# Altium schematic sheet NeoPixel.SchDoc
size A4; SheetNumber: 2; SheetTotal: 6
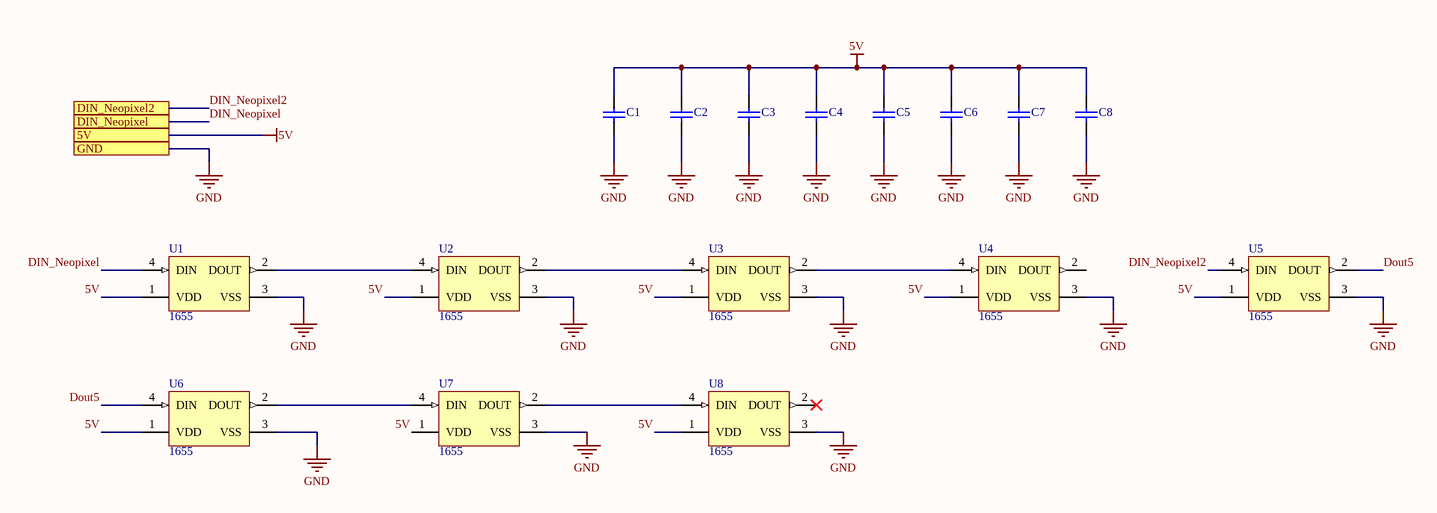
[diagram p0: NeoPixel.SchDoc]

## Parts
C1  C0805C105Z4VACTU  [CAPC2013X140X50ML20T25]  (value not drawn)
C2  C0805C105Z4VACTU  [CAPC2013X140X50ML20T25]  (value not drawn)
C3  C0805C105Z4VACTU  [CAPC2013X140X50ML20T25]  (value not drawn)
C4  C0805C105Z4VACTU  [CAPC2013X140X50ML20T25]  (value not drawn)
C5  C0805C105Z4VACTU  [CAPC2013X140X50ML20T25]  (value not drawn)
C6  C0805C105Z4VACTU  [CAPC2013X140X50ML20T25]  (value not drawn)
C7  C0805C105Z4VACTU  [CAPC2013X140X50ML20T25]  (value not drawn)
C8  C0805C105Z4VACTU  [CAPC2013X140X50ML20T25]  (value not drawn)
U1  1655  [ADA-RGB-1655_V]
U2  1655  [ADA-RGB-1655_V]
U3  1655  [ADA-RGB-1655_V]
U4  1655  [ADA-RGB-1655_V]
U5  1655  [ADA-RGB-1655_V]
U6  1655  [ADA-RGB-1655_V]
U7  1655  [ADA-RGB-1655_V]
U8  1655  [ADA-RGB-1655_V]

## Ports
5V, DIN_Neopixel, DIN_Neopixel2, GND

## Nets
5V: C1.2 C2.2 C3.2 C4.2 C5.2 C6.2 C7.2 C8.2 U1.1(VDD) U2.1(VDD) U3.1(VDD) U4.1(VDD) U5.1(VDD) U6.1(VDD) U7.1(VDD) U8.1(VDD) ; port 5V
GND: C1.1 C2.1 C3.1 C4.1 C5.1 C6.1 C7.1 C8.1 U1.3(VSS) U2.3(VSS) U3.3(VSS) U4.3(VSS) U5.3(VSS) U6.3(VSS) U7.3(VSS) U8.3(VSS) ; port GND
DIN_Neopixel: U1.4(DIN) ; port DIN_Neopixel
DIN_Neopixel2: U5.4(DIN) ; port DIN_Neopixel2
Dout5: U5.2(DOUT) U6.4(DIN)
NetU1_2: U1.2(DOUT) U2.4(DIN)
NetU2_2: U2.2(DOUT) U3.4(DIN)
NetU3_2: U3.2(DOUT) U4.4(DIN)
NetU6_2: U6.2(DOUT) U7.4(DIN)
NetU7_2: U7.2(DOUT) U8.4(DIN)

Not connected (* = marked no-connect by the designer): U4 2(DOUT); U8 2(DOUT)*

## Library data of the parts
C1-C8 = CMP-2007-03241-1: Manufacturer: Kemet; Part Number: C0805C105Z4VACTU
U1-U8 = CMP-2000-05026-1: Intelligent Control LED Integrated Light Source, 3.5 to 5.3 V, -25 to 80 degC, 4-Pin SMD, RoHS, Tape and Reel; Manufacturer: Adafruit-Industries-LLC; Number of LEDs: 10; Configuration: Discrete; Utilized LED: WS2812(5050); Datasheet URL: http://datasheet.octopart.com/ADA1655-Adafruit-Industries-datasheet-32028139.pdf; Series: Neopixel; Interface: -; Package Description: 4-Pin Surface Mount Device, Body 5 x 5 mm; Color: Red,Green,Blue(RGB); Category: Optoelectronics; Controller Type: -; Package Reference: 1655; Manufacturer URL: https://www.adafruit.com/; Mounting Type: SurfaceMount; Datasheet Version: May-13; Size / Dimension: 5.00mmLx5.00mmW; Family: Addressable,Specialty